# EAGLE design DAQ (EAGLE 9.5.0)
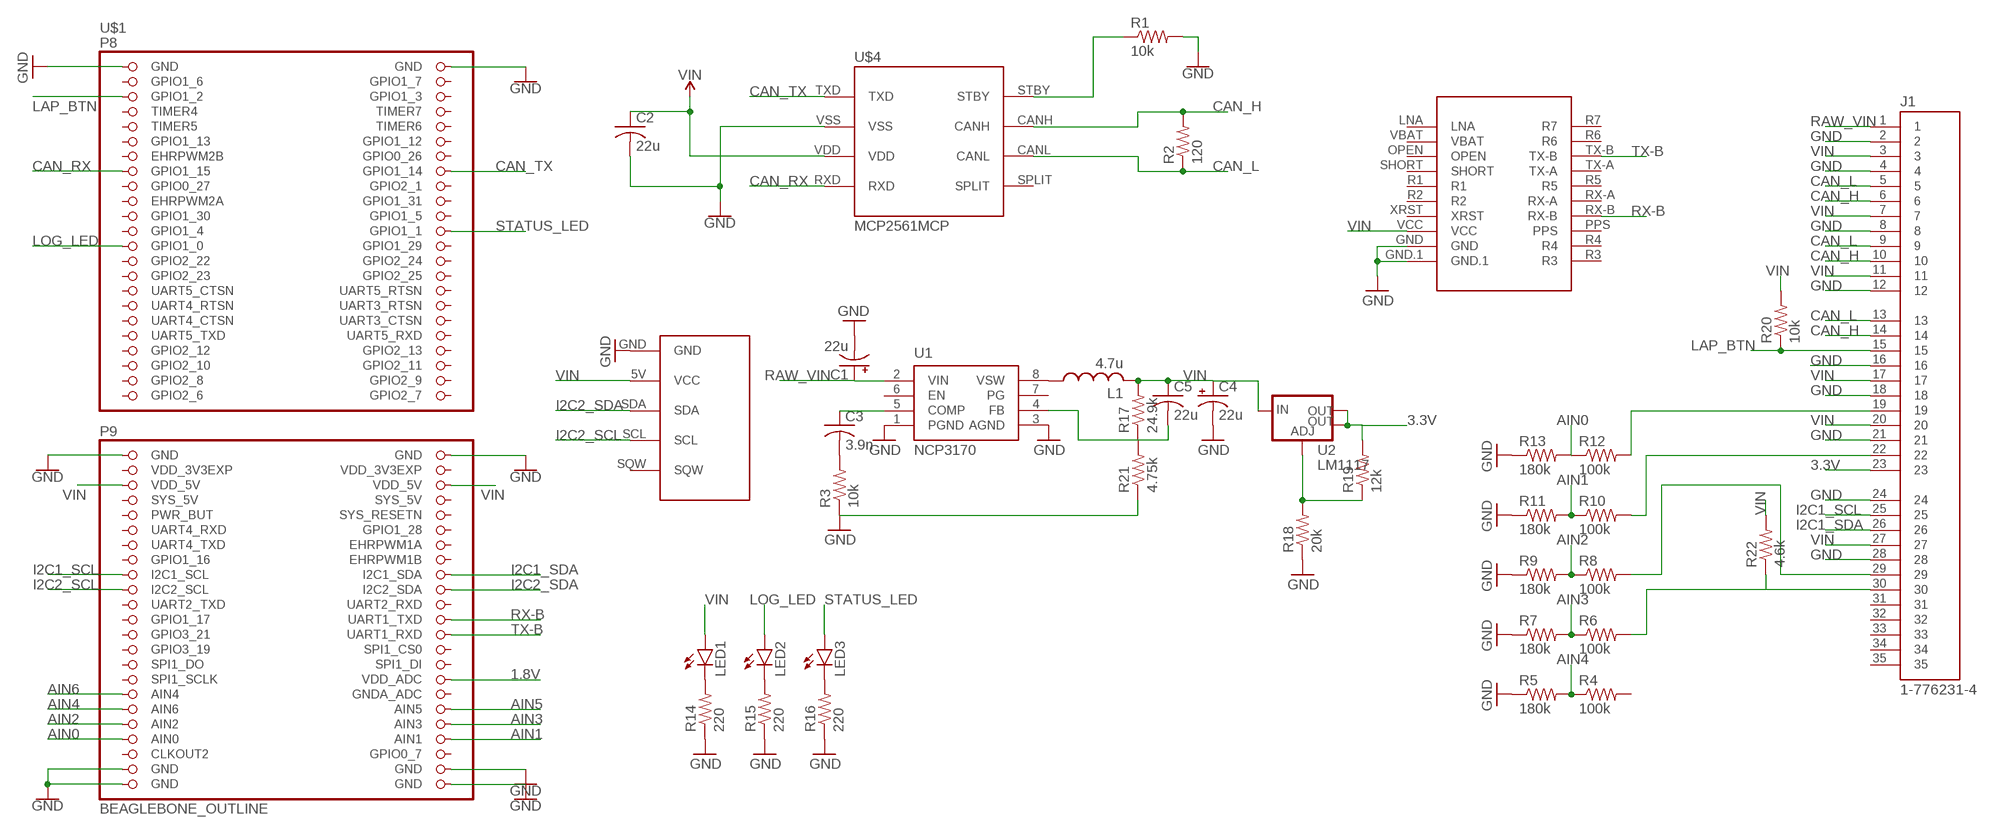
[diagram p0: schematic, sheet 1]

## Parts
C1  22u  CPOL-USE2-4  [E2-4]
C2  22u  C-US025-024X044  [C025-024X044]
C3  3.9n  C-US025-024X044  [C025-024X044]
C4  22u  CPOL-USE2-4  [E2-4]
C5  22u  C-US025-024X044  [C025-024X044]
J1  1-776231-4  [TE_1-776231-4]
L1  4.7u  L-US0207/2V  [0207/2V]
LED1  LED3MM  [LED3MM]
LED2  LED3MM  [LED3MM]
LED3  LED3MM  [LED3MM]
R1  10k  R-US_0204/7  [0204/7]
R2  120  R-US_0204/7  [0204/7]
R3  10k  R-US_0207/7  [0207/7]
R4  100k  R-US_0204/7  [0204/7]
R5  180k  R-US_0204/7  [0204/7]
R6  100k  R-US_0204/7  [0204/7]
R7  180k  R-US_0204/7  [0204/7]
R8  100k  R-US_0204/7  [0204/7]
R9  180k  R-US_0204/7  [0204/7]
R10  100k  R-US_0204/7  [0204/7]
R11  180k  R-US_0204/7  [0204/7]
R12  100k  R-US_0204/7  [0204/7]
R13  180k  R-US_0204/7  [0204/7]
R14  220  R-US_0204/7  [0204/7]
R15  220  R-US_0204/7  [0204/7]
R16  220  R-US_0204/7  [0204/7]
R17  24.9k  R-US_0207/7  [0207/7]
R18  20k  R-US_0204/7  [0204/7]
R19  12k  R-US_0204/7  [0204/7]
R20  10k  R-US_0204/7  [0204/7]
R21  4.75k  R-US_0207/7  [0207/7]
R22  4.6k  R-US_0204/7  [0204/7]
U1  NCP3170  [SOIC8]
U2  LM1117  V_REG_LM1117SOT223  [SOT223]
U$1  BEAGLEBONE_OUTLINE  [BEAGLEBONE_SHIELD]
U$2  DS1307  [DS1307_FP]
U$4  MCP2561MCP  [MCP2561_PDIP]
U$5  GPS  [GPS]

## Nets
1.8V [pwr]: U$1.78(VDD_ADC)
3.3V [pwr]: J1.23 R19.2 U2.2(OUT) U2.4(OUT)
AIN0: R12.1 R13.2 U$1.85(AIN0)
AIN1: R10.1 R11.2 U$1.86(AIN1)
AIN2: R8.1 R9.2 U$1.83(AIN2)
AIN3: J1.30 R6.1 R6.2 R7.2 R22.1 U$1.84(AIN3)
AIN4: R4.1 R5.2 U$1.81(AIN6)
AIN5: U$1.82(AIN5)
AIN6: U$1.79(AIN4)
CAN_H [pwr]: J1.6 J1.10 J1.14 R2.2 U$4.CANH
CAN_L [pwr]: J1.5 J1.9 J1.13 R2.1 U$4.CANL
CAN_RX: U$1.15(GPIO1_15) U$4.RXD
CAN_TX: U$1.16(GPIO1_14) U$4.TXD
GND [pwr]: C1.- C2.2 C4.- J1.2 J1.4 J1.8 J1.12 J1.16 J1.18 J1.21 J1.24 J1.28 R1.2 R3.1 R5.1 R7.1 R9.1 R11.1 R13.1 R14.1 R15.1 R16.1 R18.1 R21.1 U1.1(PGND) U1.3(AGND) U$1.1(GND) U$1.2(GND) U$1.47(GND) U$1.48(GND) U$1.89(GND) U$1.90(GND) U$1.91(GND) U$1.92(GND) U$2.GND U$4.VSS U$5.GND U$5.GND.1
I2C1_SCL: J1.25 U$1.63(I2C1_SCL)
I2C1_SDA: J1.26 U$1.64(I2C1_SDA)
I2C2_SCL: U$1.65(I2C2_SCL) U$2.SCL
I2C2_SDA: U$1.66(I2C2_SDA) U$2.SDA
LAP_BTN: J1.15 R20.1 U$1.5(GPIO1_2)
LOG_LED [pwr]: LED2.A U$1.25(GPIO1_0)
N$1: J1.19 R12.2
N$2: LED1.K(C) R14.2
N$3: R1.1 U$4.STBY
N$4: LED2.K(C) R15.2
N$5: LED3.K(C) R16.2
N$6: J1.22 R10.2
N$7 [pwr]: C3.2 R3.2
N$8 [pwr]: C5.2 R17.1 R21.2 U1.4(FB)
N$9 [pwr]: L1.1 U1.8(VSW)
N$10: J1.29 R8.2
N$11 [pwr]: C3.1 U1.5(COMP)
N$14 [pwr]: R18.2 R19.1 U2.1(ADJ)
RAW_VIN [pwr]: C1.+ J1.1 U1.2(VIN)
RX-B: U$1.70(UART1_TXD) U$5.RX-B
STATUS_LED [pwr]: LED3.A U$1.24(GPIO1_1)
TX-B: U$1.72(UART1_RXD) U$5.TX-B
VIN [pwr]: C2.1 C4.+ C5.1 J1.3 J1.7 J1.11 J1.17 J1.20 J1.27 L1.2 LED1.A R17.2 R20.2 R22.2 U2.3(IN) U$1.51(VDD_5V) U$1.52(VDD_5V) U$2.5V(VCC) U$4.VDD U$5.VCC
Unconnected: J1.31 J1.32 J1.33 J1.34 J1.35 R4.2 U1.6(EN) U1.7(PG) U$1.3(GPIO1_6) U$1.4(GPIO1_7) U$1.6(GPIO1_3) U$1.7(TIMER4) U$1.8(TIMER7) U$1.9(TIMER5) U$1.10(TIMER6) U$1.11(GPIO1_13) U$1.12(GPIO1_12) U$1.13(EHRPWM2B) U$1.14(GPIO0_26) U$1.17(GPIO0_27) U$1.18(GPIO2_1) U$1.19(EHRPWM2A) U$1.20(GPIO1_31) U$1.21(GPIO1_30) U$1.22(GPIO1_5) U$1.23(GPIO1_4) U$1.26(GPIO1_29) U$1.27(GPIO2_22) U$1.28(GPIO2_24) U$1.29(GPIO2_23) U$1.30(GPIO2_25) U$1.31(UART5_CTSN) U$1.32(UART5_RTSN) U$1.33(UART4_RTSN) U$1.34(UART3_RTSN) U$1.35(UART4_CTSN) U$1.36(UART3_CTSN) U$1.37(UART5_TXD) U$1.38(UART5_RXD) U$1.39(GPIO2_12) U$1.40(GPIO2_13) U$1.41(GPIO2_10) U$1.42(GPIO2_11) U$1.43(GPIO2_8) U$1.44(GPIO2_9) U$1.45(GPIO2_6) U$1.46(GPIO2_7) U$1.54(SYS_5V) U$1.55(PWR_BUT) U$1.56(SYS_RESETN) U$1.57(UART4_RXD) U$1.58(GPIO1_28) U$1.59(UART4_TXD) U$1.60(EHRPWM1A) U$1.61(GPIO1_16) U$1.62(EHRPWM1B) U$1.67(UART2_TXD) U$1.68(UART2_RXD) U$1.69(GPIO1_17) U$1.71(GPIO3_21) U$1.73(GPIO3_19) U$1.74(SPI1_CS0) U$1.75(SPI1_DO) U$1.76(SPI1_DI) U$1.77(SPI1_SCLK) U$1.80(GNDA_ADC) U$1.87(CLKOUT2) U$1.88(GPIO0_7) U$2.SQW U$4.SPLIT U$5.LNA U$5.OPEN U$5.PPS U$5.R1 U$5.R2 U$5.R3 U$5.R4 U$5.R5 U$5.R6 U$5.R7 U$5.RX-A U$5.SHORT U$5.TX-A U$5.VBAT U$5.XRST

## Power pins joined to a net without a drawn wire
SYS_5V: U$1.53(SYS_5V)
VDD_3V3EXP: U$1.49(VDD_3V3EXP) U$1.50(VDD_3V3EXP)

## Library data of the parts
C1 C4 = rcl:CPOL-US: POLARIZED CAPACITOR, American symbol; SPICEPREFIX: C
C2 C3 C5 = rcl:C-US: CAPACITOR, American symbol; SPICEPREFIX: C
J1 = 1-776231-4:1-776231-4: HEADER ASSY, 35 POS VERTICAL, GRAY; AVAILABILITY: Unavailable; COMMENT: 1-776231-4; DESCRIPTION: AMPSEAL 35 Position Three Row 0.157 inch Through-Hole Straight Sealed Pin Header; EU_ROHS_COMPLIANCE: Compliant; MF: TE Connectivity; MP: 1-776231-4; PACKAGE: None; PRICE: None; TE_PURCHASE_URL: https://www.te.com/usa-en/product-1-776231-4.html?te_bu=Cor&te_type=disp&te_campaign=seda_glo_cor-seda-global-disp-prtnr-fy19-seda-model-bom-cta_sma-317_1&elqCampaignId=32493
L1 = rcl:L-US: INDUCTOR, American symbol; SPICEPREFIX: L
LED1-LED3 = led:LED: LED OSRAM: - CHIPLED LG R971, LG N971, LY N971, LG Q971, LY Q971, LO R971, LY R971 LH N974, LH R974 LS Q976, LO Q976, LY Q976 LO Q996 - Hyper CHIPLED LW Q18S LB Q993, LB Q99A, LB R99A - SideLED LS A670, LO A670, LY A670, LG A670, LP A670 LB A673, LV A673, LT A673, LW A673 LH A674 LY A675 LS A676, LA A676, LO A676, LY A676, LW A676 LS A679, LY A679, LG A679 - Hyper Micro SIDELED® LS Y876, LA Y876, LO Y876, LY Y876 LT Y87S - SmartLED LW L88C, LW L88S LB L89C, LB L89S, LG L890 LS L89K, LO L89K, LY L89K LS L896, LA L896, LO L896, LY L896 - TOPLED LS T670, LO T670, LY T670, LG T670, LP T670 LSG T670, LSP T670, LSY T670, LOP T670, LYG T670 LG T671, LOG T671, LSG T671 LB T673, LV T673, LT T673, LW T673 LH T674 LS T676, LA T676, LO T676, LY T676, LB T676, LH T676, LSB T676, LW T676 LB T67C, LV T67C, LT T67C, LS T67K, LO T67K, LY T67K, LW E67C LS E67B, LA E67B, LO E67B, LY E67B, LB E67C, LV E67C, LT E67C LW T67C LS T679, LY T679, LG T679 LS T770, LO T770, LY T770, LG T770, LP T770 LB T773, LV T773, LT T773, LW T773 LH T774 LS E675, LA E675, LY E675, LS T675 LS T776, LA T776, LO T776, LY T776, LB T776 LHGB T686 LT T68C, LB T68C - Hyper Mini TOPLED® LB M676 - Mini TOPLED Santana® LG M470 LS M47K, LO M47K, LY M47K Source: http://www.osram.convergy.de LUXEON: - LUMILED® LXK2-PW12-R00, LXK2-PW12-S00, LXK2-PW14-U00, LXK2-PW14-V00 LXK2-PM12-R00, LXK2-PM12-S00, LXK2-PM14-U00 LXK2-PE12-Q00, LXK2-PE12-R00, LXK2-PE12-S00, LXK2-PE14-T00, LXK2-PE14-U00 LXK2-PB12-K00, LXK2-PB12-L00, LXK2-PB12-M00, LXK2-PB14-N00, LXK2-PB14-P00, LXK2-PB14-Q00 LXK2-PR12-L00, LXK2-PR12-M00, LXK2-PR14-Q00, LXK2-PR14-R00 LXK2-PD12-Q00, LXK2-PD12-R00, LXK2-PD12-S00 LXK2-PH12-R00, LXK2-PH12-S00 LXK2-PL12-P00, LXK2-PL12-Q00, LXK2-PL12-R00 Source: www.luxeon.com KINGBRIGHT: KA-3528ASYC Source: www.kingbright.com
R1-R22 = rcl:R-US_: RESISTOR, American symbol; SPICEPREFIX: R
U1 = NCP3170:NCP3170; AVAILABILITY: Unavailable; DESCRIPTION: ON Semiconductor 3A SWITCHING REGULATOR; MF: ON Semiconductor; MP: NCP3170; PACKAGE: SOIC-8 ON Semiconductor; PRICE: None
U2 = SparkFun-IC-Power:V_REG_LM1117: Voltage Regulator LM1117 Standard adjustable voltage regulator but in SMD form. Spark Fun Electronics SKU : COM-00595; PROD_ID: VREG-08170
U$1 = adafruit:BEAGLEBONE_OUTLINE: Should match A3 pinout - but not completely tested
U$2 = DS1307:DS1307: Manufacturer: Adafruit Link to Part: https://learn.adafruit.com/ds1307-real-time-clock-breakout-board-kit
U$4 = PoJD:MCP2561: High-Speed CAN Transceiver See http://ww1.microchip.com/downloads/en/DeviceDoc/25167A.pdf The MCP2561/2 is a Microchip Technology Inc. second generation high-speed CAN transceiver. It serves as an interface between a CAN protocol controller and the physical two-wire CAN bus. The device meets the automotive requirements for high-speed (up to 1 Mb/s), low quiescent current, electromagnetic compatibility (EMC) and electrostatic discharge (ESD).
U$5 = GPS_COPERNICUS:GPS

## Net classes
1 pwr: width 0.762 mm, clearance 0.381 mm

## Board
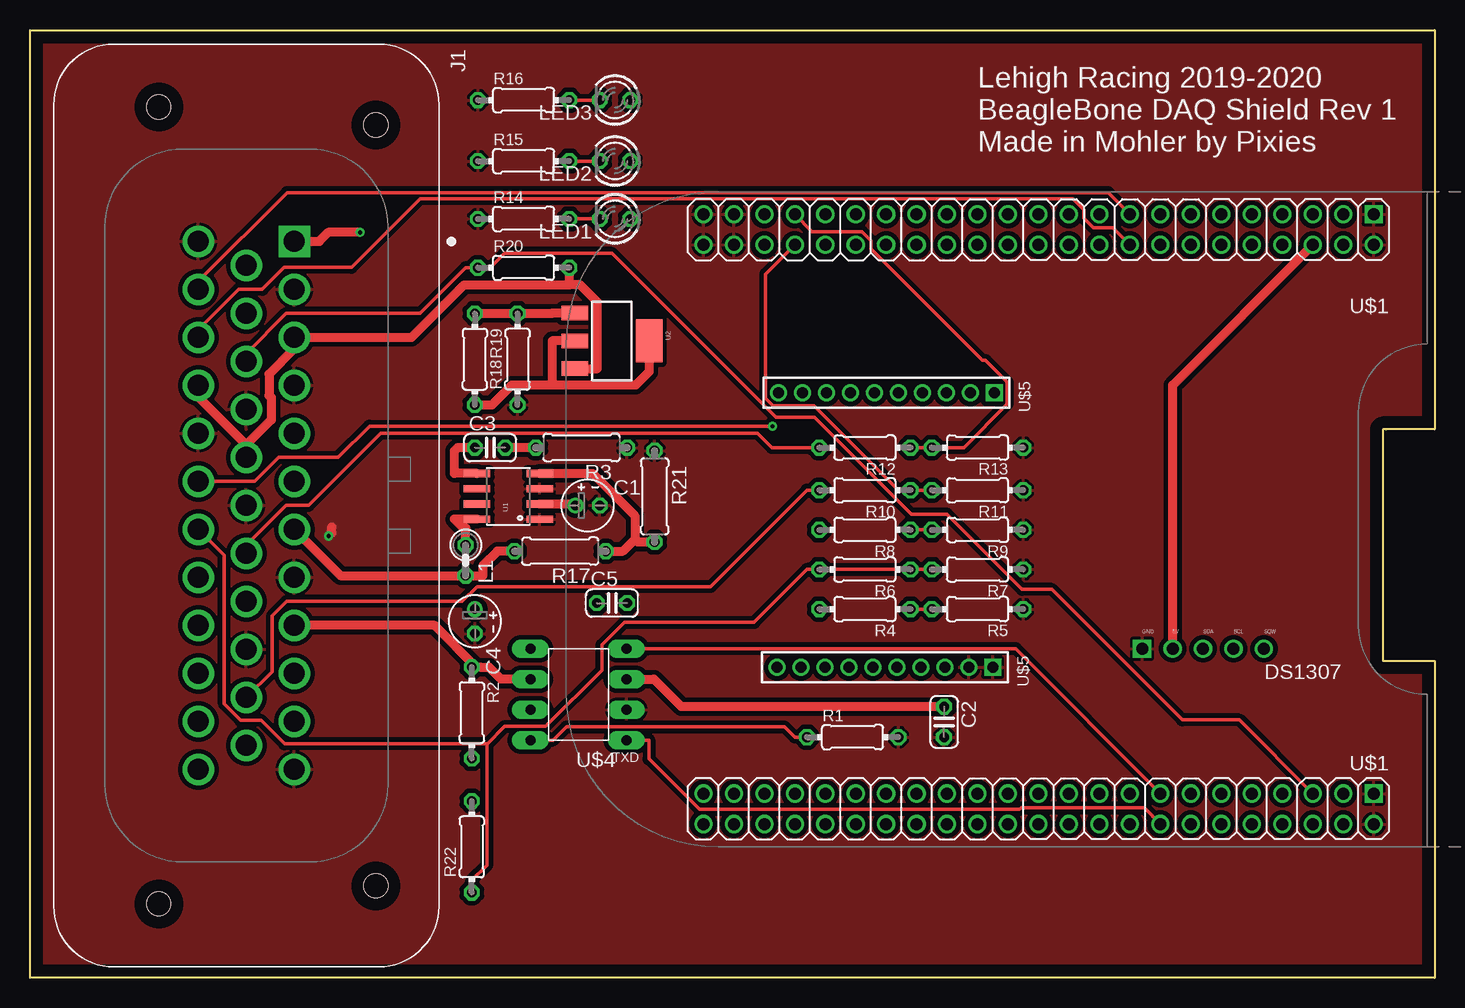
[diagram p1: board, top side]
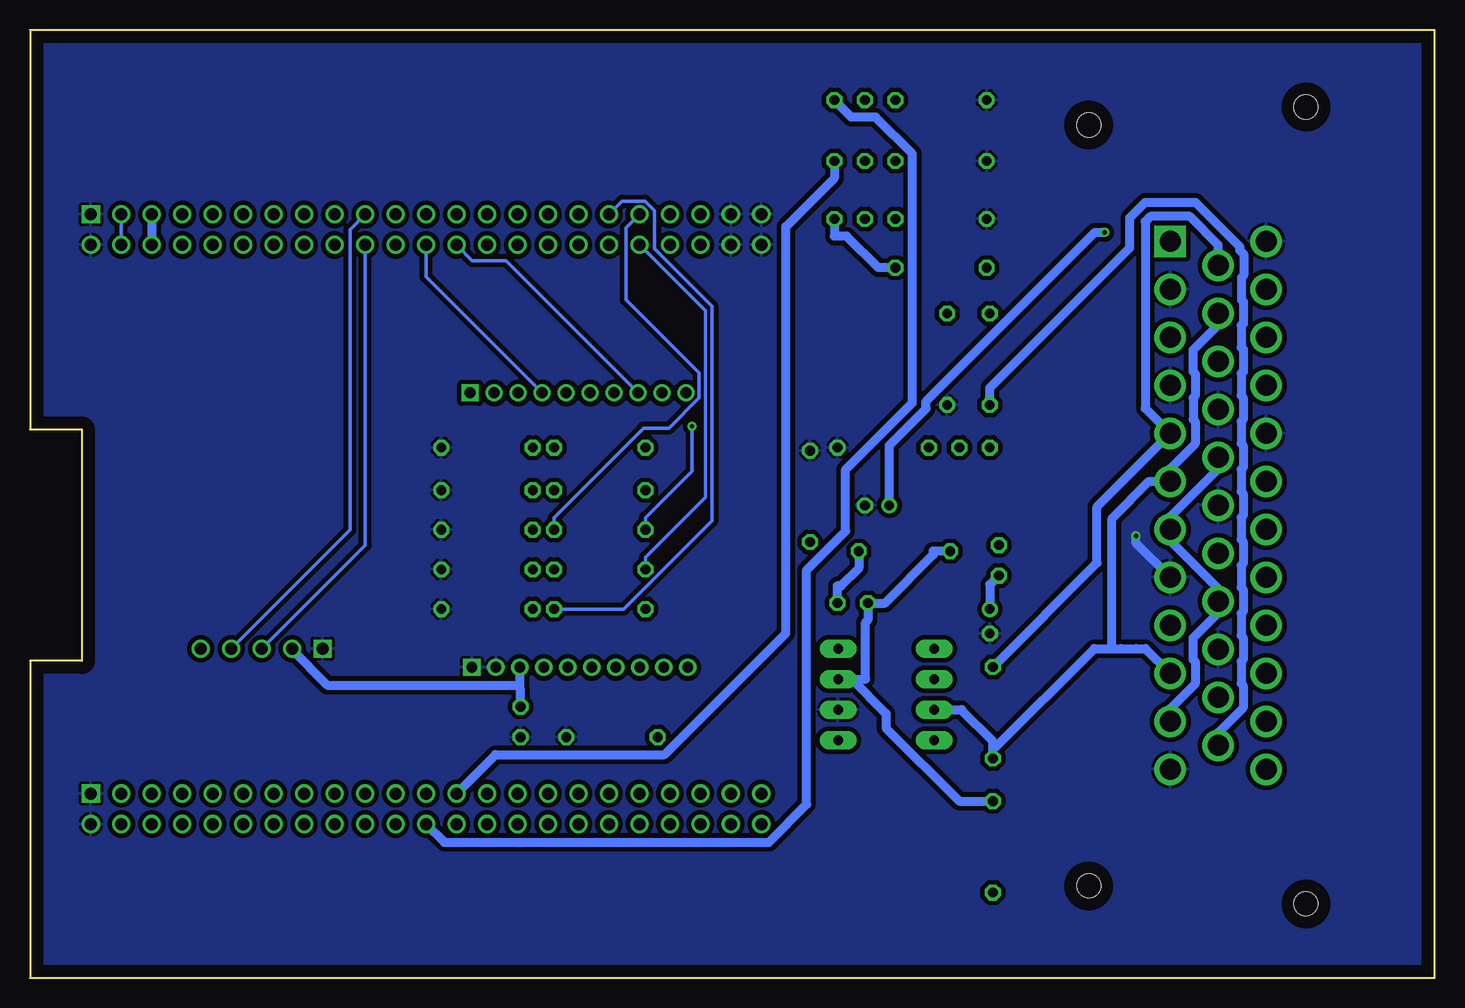
[diagram p2: board, bottom side, seen from below]

Size 117.09 x 78.99 mm. Coordinates in mm from the lower left corner, seen from the top.
Outline: 0,78.99 117.09,78.99 117.09,45.72 113.03,45.72 112.78,45.72 112.78,26.42 117.09,26.42 117.09,0 0,0 0,78.99
Copper layers (1*16): Top 0.035mm / dielectric 1.5mm / Bottom 0.035mm
Design rules "default *": minimum track width 12mil, minimum drill 0.35mm, track to track 8mil, track to pad 8mil, pad to pad 8mil, via to via 8mil, smd to smd 6mil, copper to edge 40mil, drill to drill 6mil, minimum pad ring 10mil, minimum via ring 8mil, stop-mask expansion 4mil, vias tented up to drill 0mil, thermal gap 10mil

### Footprints (pad centres in the part's own frame; a part is rotated, then mirrored left to right if it is on the bottom)
E2-4 = drill 0.813 pad 1.27: + -1.016,0 | drill 0.813 pad 1.27 octagon: - 1.016,0
C025-024X044 = drill 0.813 octagon: 1 -1.27,0; 2 1.27,0
TE_1-776231-4 = drill 1.75 square: 1 -22,4 | drill 1.75: 2 -18,4; 3 -14,4; 4 -10,4; 5 -6,4; 6 -2,4; 7 2,4; 8 6,4; 9 10,4; 10 14,4; 11 18,4; 12 22,4; 13 -20,0; 14 -16,0; 15 -12,0; 16 -8,0; 17 -4,0; 18 0,0; 19 4,0; 20 8,0; 21 12,0; 22 16,0; 23 20,0; 24 -22,-4; 25 -18,-4; 26 -14,-4; 27 -10,-4; 28 -6,-4; 29 -2,-4; 30 2,-4; 31 6,-4; 32 10,-4; 33 14,-4; 34 18,-4; 35 22,-4 | hole 2: 31.7,10.8; 33.2,-7.3; -33.2,-7.3; -31.7,10.8
0207/2V = drill 0.813 octagon: 1 -1.27,0; 2 1.27,0
LED3MM = drill 0.813 octagon: A -1.27,0; K 1.27,0
0204/7 = drill 0.813 octagon: 1 -3.81,0; 2 3.81,0
0207/7 = drill 0.813 octagon: 1 -3.81,0; 2 3.81,0
SOIC8 = smd 0.61 x 2.21: 1 -1.905,-2.616; 2 -0.635,-2.616; 3 0.635,-2.616; 4 1.905,-2.616; 5 1.905,2.616; 6 0.635,2.616; 7 -0.635,2.616; 8 -1.905,2.616
SOT223 = smd 1.219 x 2.235: 1 -2.311,-3.099; 2 0,-3.099; 3 2.311,-3.099 | smd 3.6 x 2.2: 4 0,3.099
BEAGLEBONE_SHIELD = drill 1 square: 1 4.445,19.05; 47 52.705,19.05 | drill 1: 2 1.905,19.05; 3 4.445,21.59; 4 1.905,21.59; 5 4.445,24.13; 6 1.905,24.13; 7 4.445,26.67; 8 1.905,26.67; 9 4.445,29.21; 10 1.905,29.21; 11 4.445,31.75; 12 1.905,31.75; 13 4.445,34.29; 14 1.905,34.29; 15 4.445,36.83; 16 1.905,36.83; 17 4.445,39.37; 18 1.905,39.37; 19 4.445,41.91; 20 1.905,41.91; 21 4.445,44.45; 22 1.905,44.45; 23 4.445,46.99; 24 1.905,46.99; 25 4.445,49.53; 26 1.905,49.53; 27 4.445,52.07; 28 1.905,52.07; 29 4.445,54.61; 30 1.905,54.61; 31 4.445,57.15; 32 1.905,57.15; 33 4.445,59.69; 34 1.905,59.69; 35 4.445,62.23; 36 1.905,62.23; 37 4.445,64.77; 38 1.905,64.77; 39 4.445,67.31; 40 1.905,67.31; 41 4.445,69.85; 42 1.905,69.85; 43 4.445,72.39; 44 1.905,72.39; 45 4.445,74.93; 46 1.905,74.93; 48 50.165,19.05; 49 52.705,21.59; 50 50.165,21.59; 51 52.705,24.13; 52 50.165,24.13; 53 52.705,26.67; 54 50.165,26.67; 55 52.705,29.21; 56 50.165,29.21; 57 52.705,31.75; 58 50.165,31.75; 59 52.705,34.29; 60 50.165,34.29; 61 52.705,36.83; 62 50.165,36.83; 63 52.705,39.37; 64 50.165,39.37; 65 52.705,41.91; 66 50.165,41.91; 67 52.705,44.45; 68 50.165,44.45; 69 52.705,46.99; 70 50.165,46.99; 71 52.705,49.53; 72 50.165,49.53; 73 52.705,52.07; 74 50.165,52.07; 75 52.705,54.61; 76 50.165,54.61; 77 52.705,57.15; 78 50.165,57.15; 79 52.705,59.69; 80 50.165,59.69; 81 52.705,62.23; 82 50.165,62.23; 83 52.705,64.77; 84 50.165,64.77; 85 52.705,67.31; 86 50.165,67.31; 87 52.705,69.85; 88 50.165,69.85; 89 52.705,72.39; 90 50.165,72.39; 91 52.705,74.93; 92 50.165,74.93
DS1307_FP = drill 1: 5V 2.54,0; SCL 7.62,0; SDA 5.08,0; SQW 10.16,0 | drill 1 square: GND 0,0
MCP2561_PDIP = drill 0.813 pad 1.524 long: CANH 4,1.27; CANL 4,-1.27; RXD -4,-3.81; SPLIT 4,-3.81; STBY 4,3.81; TXD -4,3.81; VDD -4,-1.27; VSS -4,1.27
GPS = drill 0.914: GND -9.68,62.52; LNA 6.32,62.52; OPEN 2.32,62.52; PPS -7.81,39.64; R1 -1.68,62.52; R2 -3.68,62.52; R4 -9.81,39.64; R5 -1.81,39.64; R6 4.19,39.64; R7 6.19,39.64; RX-A -3.81,39.64; RX-B -5.81,39.64; SHORT 0.32,62.52; TX-A 0.19,39.64; TX-B 2.19,39.64; VBAT 4.32,62.52; VCC -7.68,62.52; XRST -5.68,62.52 | drill 0.914 square: GND.1 -11.68,62.52; R3 -11.81,39.64

### Placement (x,y rotation side)
C1  46.48,39.37 0 top
C2  76.2,21.34 270 top
C3  38.35,44.2 0 top
C4  37.08,29.72 270 top
C5  48.51,31.24 0 top
J1  18.03,39.37 270 top
L1  36.32,34.8 270 top
LED1  48.77,63.25 180 top
LED2  48.77,68.07 180 top
LED3  48.77,73.15 180 top
R1  68.58,20.07 0 top
R2  36.83,22.1 270 top
R3  45.97,44.2 180 top
R4  69.6,30.73 180 top
R5  78.99,30.73 180 top
R6  69.6,34.04 180 top
R7  78.99,34.04 180 top
R8  69.6,37.34 180 top
R9  78.99,37.34 180 top
R10  69.6,40.64 180 top
R11  78.99,40.64 180 top
R12  69.6,44.2 180 top
R13  78.99,44.2 180 top
R14  41.15,63.25 0 top
R15  41.15,68.07 0 top
R16  41.15,73.15 0 top
R17  44.2,35.56 180 top
R18  40.64,51.56 90 top
R19  37.08,51.56 270 top
R20  41.15,59.18 0 top
R21  52.07,40.13 270 top
R22  36.83,10.92 90 top
U1  39.88,40.13 90 top
U2  48.51,53.09 270 top
U$1  131.06,10.92 90 top
U$2  92.71,27.43 0 top
U$4  45.72,23.62 180 top
U$5  68.58,88.39 180 top

### Tracks (layer width: path | path; a pad name or v marks a point on that pad's centre or on a via)
3.3V
  Top 0.762: 43.54,49.4 40.16,49.4 38.51,47.75 R19.2 | 43.54,49.4 50.49,49.4 51.61,50.52 U2.4 | 43.54,49.4 43.54,53.09 U2.2
  Bottom 0.762: R19.2 37.08,49.17 25.42,60.84 25.42,63.34 24.12,64.64 19.94,64.64 16.25,60.95 16.25,60.66 15.93,60.33 15.93,58.55 16.11,58.36 16.11,56.51 15.94,56.35 15.94,54.53 16.12,54.35 16.12,52.52 15.95,52.35 15.95,50.52 16.12,50.35 16.12,48.52 15.95,48.35 15.95,46.52 16.12,46.35 16.12,44.52 15.95,44.35 15.95,42.52 16.12,42.35 16.12,40.52 15.95,40.35 15.95,38.52 16.12,38.35 16.12,36.52 15.95,36.35 15.95,34.52 16.12,34.35 16.12,32.52 15.95,32.35 15.95,30.52 16.12,30.35 16.12,28.52 15.95,28.35 15.95,26.52 16.12,26.35 16.12,24.52 15.95,24.35 15.95,22.52 18.03,20.44 J1.23
AIN0
  Top 0.305: U$1.85 65.18,62.2 69.34,62.2 70.1,61.43 70.1,60.76 79.39,51.47 79.65,51.47 81.46,49.66 81.46,47.81 77.84,44.2 R13.2 R12.1
AIN1
  Top 0.305: U$1.86 61.32,58.66 61.32,48.29 61.92,47.69 65.34,47.69 72.39,40.64 R10.1 R11.2
AIN2
  Top 0.305: R9.2 R8.1
  Bottom 0.305: R8.1 73.41,38.35 65.95,45.81 63.83,45.81 61.3,48.33 61.3,50.41 67.41,56.51 67.41,62.52 U$1.83
AIN3
  Top 0.305: 38.1,19.48 39.58,20.96 42.98,20.96 47.68,25.66 47.68,27.76 49.55,29.63 60.37,29.63 64.77,34.04 R6.2 R6.1 R7.2 | 38.1,19.48 38.08,19.5 21.22,19.5 19.26,21.47 17.55,21.47 16.19,22.83 16.19,35.22 J1.30 | 38.1,19.48 38.1,9.4 36.83,8.13 R22.1
  Bottom 0.305: R6.2 65.79,35.05 60.79,40.05 60.79,55.58 U$1.84
AIN4
  Top 0.305: R5.2 R4.1
  Bottom 0.305: U$1.81 67.72,64.74 65.83,64.74 65.02,63.94 65.02,60.76 60.25,55.99 60.25,38.09 67.61,30.73 R4.1
CAN_H
  Bottom 0.762: 26.9,27.45 26.9,38.28 23.81,41.37 J1.6 22.03,42.44 19.95,44.52 19.95,46.35 20.12,46.53 20.12,48.35 19.96,48.51 19.96,50.36 20.14,50.55 20.14,52.33 18.03,54.44 J1.14 | J1.10 24.11,27.45 24.87,27.45 26.14,27.45 26.9,27.45 | 36.83,19 28.39,27.45 26.9,27.45 | 36.83,19 36.83,19.71 39.43,22.31 39.43,22.35 U$4.CANH | R2.2 36.83,19
CAN_L
  Top 0.762: 37.2,25.91 33.74,29.37 J1.9 | R2.1 37.2,25.91 | 37.2,25.91 37.54,25.91 38.25,25.91 39.27,24.89 U$4.CANL
  Bottom 0.762: R2.1 28.14,34.6 28.14,39.26 J1.5 24.12,47.46 24.12,63.02 23.68,63.46 20.42,63.46 18.03,61.07 J1.13
CAN_RX
  Top 0.305: U$1.15 82.17,27.43 51.6,27.43 U$4.RXD
CAN_TX
  Top 0.305: U$4.TXD 51.6,19.81 51.6,18.26 55.81,14.05 82.5,14.05 82.63,14.18 92.88,14.18 U$1.16
GND  (via drill 0.35)
  Top 0.762: v24.89,36.83 25.15,37.08 25.15,37.59
  Bottom 0.762: J1.8 24.89,36.23 v24.89,36.83
  pour Top: 0.25,78.99 117.09,78.99 117.09,0.3 0.25,0.3
  pour Bottom: 0,78.99 116.84,78.99 117.09,78.99 117.09,0 0,0
I2C1_SCL
  Top 0.305: U$1.63 89.88,65.44 21.42,65.44 14.03,58.05 J1.25
I2C1_SDA
  Top 0.305: U$1.64 90.26,62.52 88.65,62.52 87.86,63.3 87.86,64.02 86.95,64.93 32.51,64.93 26.8,59.22 21.2,59.22 19.35,57.37 17.38,57.37 14.03,54.03 J1.26
I2C2_SCL
  Bottom 0.305: U$2.SCL 90.42,37.34 90.42,62.36 U$1.65
I2C2_SDA
  Bottom 0.305: U$2.SDA 89.15,36.07 U$1.66
LAP_BTN
  Top 0.305: U$1.5 100.8,21.51 96.05,21.51 85.17,32.38 82.7,32.38 76.42,38.66 73.46,38.66 65.41,46.71 62.18,46.71 48.51,60.38 39.55,60.38 38.35,59.18 R20.1 36.32,59.18 32.51,55.37 21.37,55.37 18.03,52.03 J1.15
LOG_LED
  Bottom 0.762: LED2.A 50.04,66.65 54.09,62.6 54.09,28.72 64.2,18.61 78.29,18.61 U$1.25
N$1
  Top 0.305: R12.2 64.77,44.2 61.85,44.2 60.65,45.4 29.25,45.4 23.22,39.37 21.35,39.37 18.03,36.05 J1.19
N$2
  Top 0.305: R14.2 LED1.K
N$3
  Top 0.305: R1.1 63.75,20.07 62.89,20.93 44.72,20.93 43.6,19.81 U$4.STBY
N$4
  Top 0.305: R15.2 LED2.K
N$5
  Top 0.305: R16.2 LED3.K
N$6
  Top 0.305: R10.2 64.77,40.64 56.74,32.61 37.27,32.61 36.03,31.37 21.39,31.37 20.19,30.17 20.19,25.52 J1.22
N$7
  Top 0.762: R3.2 C3.2
N$8
  Top 0.762: U1.4 44.36,42.04 46.89,42.04 50.42,38.51 50.42,36.55 | 50.42,36.55 49.43,35.56 R17.1 | 50.42,36.55 50.65,36.32 R21.2
  Bottom 0.762: C5.2 49.78,32.66 49.48,32.66 48.01,34.14 R17.1
N$9
  Top 0.762: L1.1 36.32,37.49 36.13,37.49 35.4,38.23 U1.8
N$10  (via drill 0.35 pad 0.76)
  Top 0.305: J1.29 18.71,41.37 20.71,43.37 25.7,43.37 28.3,45.98 v61.9,45.98
  Bottom 0.305: v61.9,45.98 61.9,42.24 65.79,38.35 R8.2
N$11
  Top 0.762: C3.1 35.66,44.2 35.4,43.93 35.4,42.04 U1.5
N$14
  Top 0.762: U2.1 43.54,55.4 43.51,55.37 R18.2 R19.1
RAW_VIN  (via drill 0.35 pad 0.76)
  Top 0.762: J1.1 24.11,61.37 24.86,62.12 v27.51,62.12 | U1.2 45.34,39.5 C1.+
  Bottom 0.762: C1.+ 45.47,44.38 42.39,47.45 42.39,48.05 28.32,62.12 v27.51,62.12
RX-B
  Bottom 0.305: U$5.RX-B 84.07,58.44 U$1.70
STATUS_LED
  Bottom 0.762: U$1.24 82.55,11.3 55.5,11.3 52.35,14.45 52.35,33.98 49.1,37.23 49.1,42.36 43.54,47.92 43.54,68.67 46.6,71.73 48.62,71.73 LED3.A
TX-B
  Bottom 0.305: U$5.TX-B 77.42,59.78 80.22,59.78 U$1.72
VDD_3V3EXP
  Bottom 0.305: U$1.50 U$1.49
VIN
  Top 0.762: 44.96,57.76 36.19,57.76 31.8,53.37 J1.3 22.03,52.43 19.93,50.32 19.93,48.55 20.11,48.36 20.11,46.51 18.03,44.44 | R20.2 44.96,57.76 | U2.3 47.3,50.77 47.3,56.32 45.86,57.76 44.96,57.76 | 18.03,44.44 14.03,48.44 J1.27 | 18.03,44.44 J1.17 | U$2.5V 95.25,49.4 U$1.52 | U$4.VDD 52.01,24.89 54.29,22.61 74.78,22.61 C2.1 | J1.7 25.88,33.53 L1.2 37.74,33.53 37.74,34.34 38.96,35.56 R17.2
  Bottom 0.762: LED1.A 50.04,61.82 49.02,61.82 46.38,59.18 R20.2 | 48.58,24.89 45.72,22.04 45.72,20.82 39.63,14.73 R22.2 | 48.58,24.89 47.43,24.89 47.43,29.63 47.24,29.82 C5.1 45.82,31.24 41.81,35.26 41.81,35.56 R17.2 | U$4.VDD 48.58,24.89 | J1.17 18.03,42.44 22.03,38.44 J1.7 22.03,36.44 18.03,32.44 J1.20 18.03,30.44 20.14,28.33 20.14,26.55 19.96,26.36 19.96,24.51 22.03,22.44 J1.11 | C2.1 76.2,24.03 76.26,24.09 76.26,24.39 | 76.26,24.39 U$5.VCC | U$2.5V 95.25,27.34 92.31,24.39 76.26,24.39 | L1.2 37.08,32.77 C4.+ | U$1.51 U$1.52

### Text on the board
tPlace: Lehigh Racing 2019-2020 / BeagleBone DAQ Shield Rev 1 / Made in Mohler by Pixies